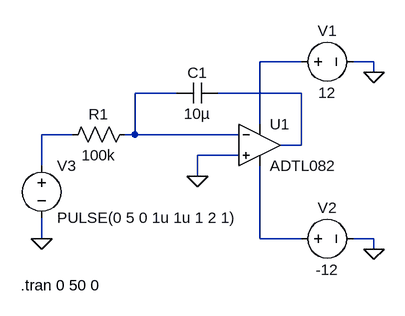
[diagram p0: schematic Circuito5.asc]
Circuito5.asc, the LTspice schematic file:
Version 4.1
SHEET 1 880 680
WIRE 368 64 304 64
WIRE 480 64 448 64
WIRE 480 80 480 64
WIRE 176 112 112 112
WIRE 368 112 240 112
WIRE 304 160 304 64
WIRE 16 176 -32 176
WIRE 112 176 112 112
WIRE 112 176 96 176
WIRE 272 176 112 176
WIRE 368 192 368 112
WIRE 368 192 336 192
WIRE 272 208 208 208
WIRE -32 224 -32 176
WIRE 208 240 208 208
WIRE -32 336 -32 304
WIRE 304 336 304 224
WIRE 368 336 304 336
WIRE 480 336 448 336
WIRE 480 352 480 336
FLAG 480 80 0
FLAG 480 352 0
FLAG 208 240 0
FLAG -32 336 0
SYMBOL res 112 160 R90
WINDOW 0 0 56 VBottom 2
WINDOW 3 32 56 VTop 2
SYMATTR InstName R1
SYMATTR Value 100k
SYMBOL cap 240 96 R90
WINDOW 0 0 32 VBottom 2
WINDOW 3 32 32 VTop 2
SYMATTR InstName C1
SYMATTR Value 10µ
SYMBOL OpAmps\\ADTL082 304 128 R0
SYMATTR InstName U1
SYMBOL voltage 352 64 R270
WINDOW 0 32 56 VTop 2
WINDOW 3 -32 56 VBottom 2
WINDOW 123 0 0 Left 0
WINDOW 39 0 0 Left 0
SYMATTR InstName V1
SYMATTR Value 12
SYMBOL voltage 352 336 R270
WINDOW 0 32 56 VTop 2
WINDOW 3 -32 56 VBottom 2
WINDOW 123 0 0 Left 0
WINDOW 39 0 0 Left 0
SYMATTR InstName V2
SYMATTR Value -12
SYMBOL voltage -32 208 R0
WINDOW 123 0 0 Left 0
WINDOW 39 0 0 Left 0
SYMATTR InstName V3
SYMATTR Value PULSE(0 5 0 1u 1u 1 2 1)
TEXT -64 408 Left 2 !.tran 0 50 0

The netlist it stands for:
* Circuito5.asc
R1 N002 N004 100k
C1 N003 N002 10µ
X§U1 0 N002 N001 N005 N003 ADTL082  ; pins In+ In- V+ V- OUT
V1 N001 0 12
V2 N005 0 -12
V3 N004 0 PULSE(0 5 0 1u 1u 1 2 1)
.tran 0 50 0
.lib ADI.lib
.backanno
.end